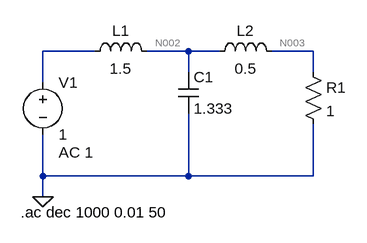
[diagram p0: schematic cuadripolo_ts8.asc]
cuadripolo_ts8.asc, the LTspice schematic file:
Version 4
SHEET 1 880 680
WIRE 160 112 80 112
WIRE 304 112 240 112
WIRE 352 112 304 112
WIRE 496 112 432 112
WIRE 304 144 304 112
WIRE 496 144 496 112
WIRE 80 160 80 112
WIRE 80 304 80 240
WIRE 304 304 304 208
WIRE 304 304 80 304
WIRE 496 304 496 224
WIRE 496 304 304 304
WIRE 80 336 80 304
FLAG 80 336 0
SYMBOL voltage 80 144 R0
WINDOW 123 24 124 Left 2
WINDOW 39 0 0 Left 0
SYMATTR InstName V1
SYMATTR Value 1
SYMATTR Value2 AC 1
SYMBOL ind 144 128 R270
WINDOW 0 32 56 VTop 2
WINDOW 3 5 56 VBottom 2
SYMATTR InstName L1
SYMATTR Value 1.5
SYMBOL ind 336 128 R270
WINDOW 0 32 56 VTop 2
WINDOW 3 5 56 VBottom 2
SYMATTR InstName L2
SYMATTR Value 0.5
SYMBOL cap 288 144 R0
SYMATTR InstName C1
SYMATTR Value 1.333
SYMBOL res 480 128 R0
SYMATTR InstName R1
SYMATTR Value 1
TEXT 46 360 Left 2 !.ac dec 1000 0.01 50

The netlist it stands for:
* cuadripolo_ts8.asc
V1 N001 0 1 AC 1
L1 N001 N002 1.5
L2 N002 N003 0.5
C1 N002 0 1.333
R1 N003 0 1
.ac dec 1000 0.01 50
.backanno
.end

* Results of the author's LTspice run, read from the files saved beside the schematic
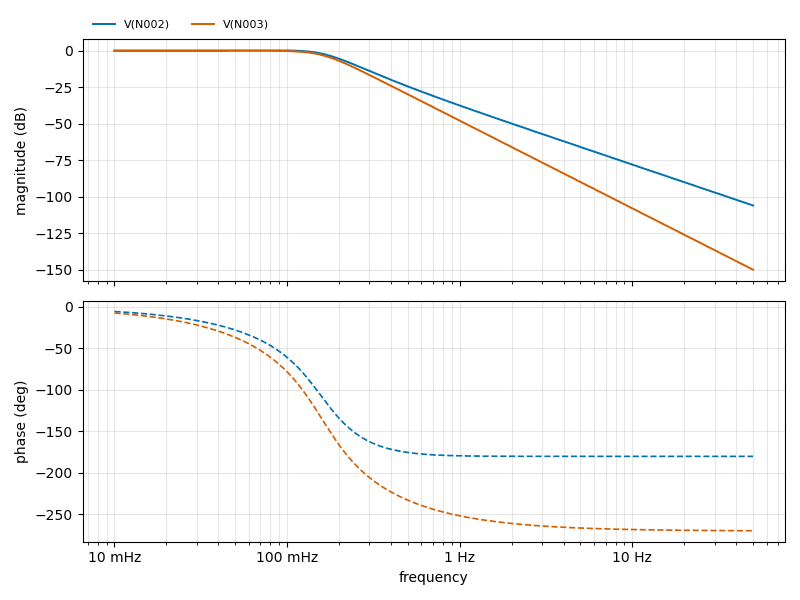
[diagram p1: AC Analysis of cuadripolo_ts8.asc, plotted from the saved traces]
* AC Analysis, 1 run:
*   V(N002): -0.00 dB at 10 mHz, -105.90 dB at 50 Hz, peak 0.20 dB at 84.92 mHz, 3 dB below the peak at 169.4 mHz
*   V(N003): -0.02 dB at 10 mHz, -149.83 dB at 50 Hz, peak -0.02 dB at 34.12 mHz, 3 dB below the peak at 159.3 mHz